# EAGLE schematic led3v (EAGLE 7.5.0)
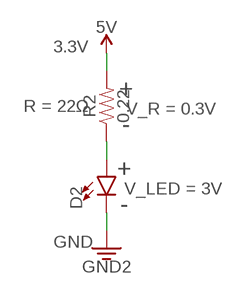
[diagram p0: schematic, sheet 1]

## Parts
D2  LED5MM  [LED_5MM]
R2  0.22  0.22OHM-0805-1/4W-1%  [0805]

## Nets
5V: R2.2
N$3: D2.A R2.1
Unconnected: D2.K(C)

## Notes on the sheet
- 3.3V
- +
- R = 22Ω
- V_R = 0.3V
- -
- +
- V_LED = 3V
- -
- GND

## Library data of the parts
D2 = SparkFun-LED:LED: LED (Generic) Standard schematic elements and footprints for 5mm, 3mm, 1206, and 0603 sized LEDs. Generic LEDs with no color specified.
R2 = SparkFun-Resistors:0.22OHM: 0.22Ω resistor A resistor is a passive two-terminal electrical component that implements electrical resistance as a circuit element. Resistors act to reduce current flow, and, at the same time, act to lower voltage levels within circuits. - Wikipedia; PROD_ID: RES-09883